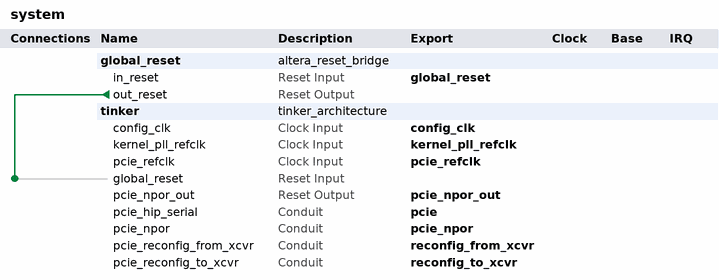
[diagram p0: system contents]
# Platform Designer (Qsys) system system, Stratix V 5SGXEA7N2F45C2
# Parameters at their usual value, and those the tool derives, are not listed.
package require -exact qsys 15.1
create_system system
set_project_property DEVICE_FAMILY {Stratix V}
set_project_property DEVICE 5SGXEA7N2F45C2

add_instance global_reset altera_reset_bridge 15.1
set_instance_parameter_value global_reset ACTIVE_LOW_RESET 1
set_instance_parameter_value global_reset SYNCHRONOUS_EDGES none

add_instance tinker tinker_architecture 15.1
set_instance_parameter_value tinker BOARD_PATH ..

# connections
add_connection global_reset.out_reset tinker.global_reset reset

# exported interfaces
add_interface config_clk clock sink
set_interface_property config_clk EXPORT_OF tinker.config_clk
add_interface global_reset reset sink
set_interface_property global_reset EXPORT_OF global_reset.in_reset
add_interface kernel_pll_refclk clock sink
set_interface_property kernel_pll_refclk EXPORT_OF tinker.kernel_pll_refclk
add_interface pcie conduit end
set_interface_property pcie EXPORT_OF tinker.pcie_hip_serial
add_interface pcie_npor conduit end
set_interface_property pcie_npor EXPORT_OF tinker.pcie_npor
add_interface pcie_npor_out reset source
set_interface_property pcie_npor_out EXPORT_OF tinker.pcie_npor_out
add_interface pcie_refclk clock sink
set_interface_property pcie_refclk EXPORT_OF tinker.pcie_refclk
add_interface reconfig_from_xcvr conduit end
set_interface_property reconfig_from_xcvr EXPORT_OF tinker.pcie_reconfig_from_xcvr
add_interface reconfig_to_xcvr conduit end
set_interface_property reconfig_to_xcvr EXPORT_OF tinker.pcie_reconfig_to_xcvr

set_interconnect_requirement {$system} qsys_mm.clockCrossingAdapter FIFO
set_interconnect_requirement {$system} qsys_mm.maxAdditionalLatency 0

save_system system.qsys
